# Altium schematic sheet stm32h750xbh6.SchDoc: MCU
size A4; Date: 10.04.2025; CheckedBy: BCY; DrawnBy: miaow; DocumentNumber: 5; Revision: v0.0.1; SheetNumber: 5; SheetTotal: 12; Sample: A0; Url: github.com/miaow-cn/pcb-lib; Liscense: GPLv3; Board: MIAOW FOC BOARD; BoardType: MAIN_PCB; Desc: stm32h750xbh6
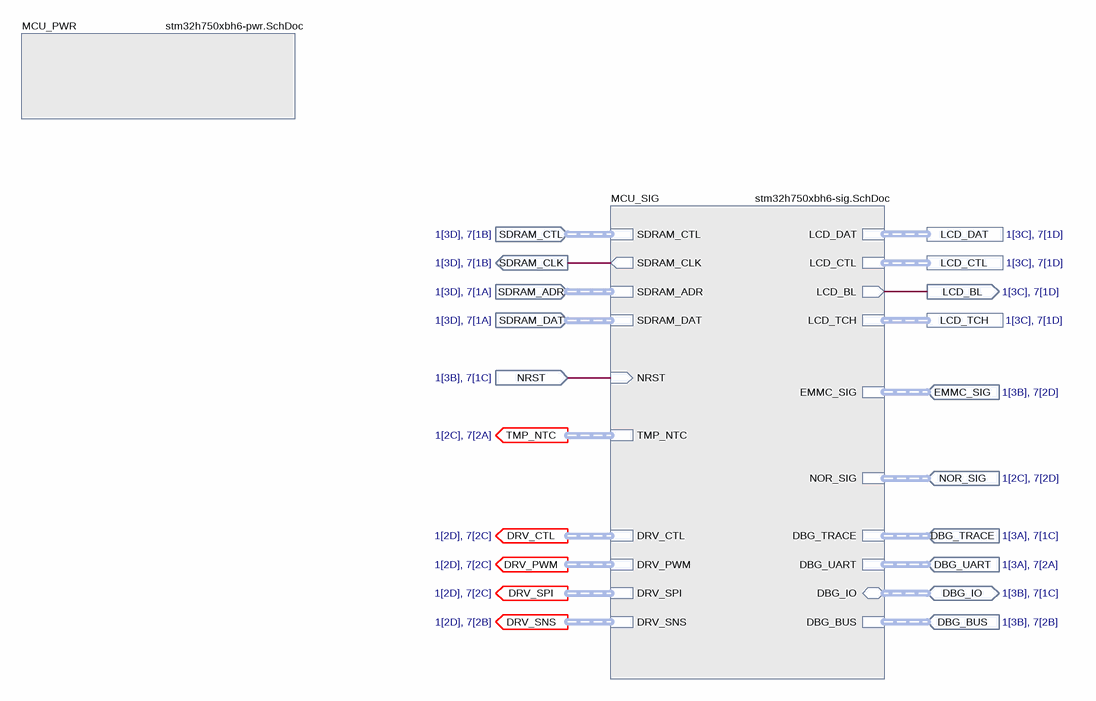
[diagram p0: stm32h750xbh6.SchDoc]

## Sub-sheets
MCU_PWR = stm32h750xbh6-pwr.SchDoc: no entries
MCU_SIG = stm32h750xbh6-sig.SchDoc: SDRAM_CTL (harness SDRAM_CTL), SDRAM_CLK (out), SDRAM_DAT (harness SDRAM_DAT), SDRAM_ADR (harness SDRAM_ADR), NRST (in), DRV_CTL (harness DRV_CTL), DRV_PWM (harness DRV_PWM), DRV_SPI (harness DRV_SPI), DRV_SNS (harness DRV_SNS), LCD_DAT (harness LCD_DAT), LCD_CTL (harness LCD_CTL), LCD_BL (out), LCD_TCH (harness LCD_TCH), EMMC_SIG (harness EMMC_SIG), NOR_SIG (harness NOR_SIG), DBG_TRACE (harness DBG_TRACE), DBG_UART (harness DBG_UART), DBG_IO (bidir, harness DBG_IO), DBG_BUS (harness DBG_BUS), TMP_NTC (harness TMP_NTC)

## Ports
DBG_BUS (in, harness DBG_BUS, see 1[3B], 7[2B]), DBG_IO (bidir, harness DBG_IO, see 1[3B], 7[1C]), DBG_TRACE (in, harness DBG_TRACE, see 1[3A], 7[1C]), DBG_UART (in, harness DBG_UART, see 1[3A], 7[2A]), DRV_CTL (out, harness DRV_CTL, see 1[2D], 7[2C]), DRV_PWM (out, harness DRV_PWM, see 1[2D], 7[2C]), DRV_SNS (out, harness DRV_SNS, see 1[2D], 7[2B]), DRV_SPI (out, harness DRV_SPI, see 1[2D], 7[2C]), EMMC_SIG (in, harness EMMC_SIG, see 1[3B], 7[2D]), LCD_BL (out, see 1[3C], 7[1D]), LCD_CTL (harness LCD_CTL, see 1[3C], 7[1D]), LCD_DAT (harness LCD_DAT, see 1[3C], 7[1D]), LCD_TCH (harness LCD_TCH, see 1[3C], 7[1D]), NOR_SIG (in, harness NOR_SIG, see 1[2C], 7[2D]), NRST (in, see 1[3B], 7[1C]), SDRAM_ADR (in, harness SDRAM_ADR, see 1[3D], 7[1A]), SDRAM_CLK (out, see 1[3D], 7[1B]), SDRAM_CTL (in, harness SDRAM_CTL, see 1[3D], 7[1B]), SDRAM_DAT (in, harness SDRAM_DAT, see 1[3D], 7[1A]), TMP_NTC (out, harness TMP_NTC, see 1[2C], 7[2A])

## Nets
LCD_BL: port LCD_BL, sheet MCU_SIG/LCD_BL
NRST: port NRST, sheet MCU_SIG/NRST
SDRAM_CLK: port SDRAM_CLK, sheet MCU_SIG/SDRAM_CLK

## Buses and harness runs
harness port DBG_BUS = sheet MCU_SIG/DBG_BUS
harness port DBG_IO = sheet MCU_SIG/DBG_IO
harness port DBG_TRACE = sheet MCU_SIG/DBG_TRACE
harness port DBG_UART = sheet MCU_SIG/DBG_UART
harness port DRV_CTL = sheet MCU_SIG/DRV_CTL
harness port DRV_PWM = sheet MCU_SIG/DRV_PWM
harness port DRV_SNS = sheet MCU_SIG/DRV_SNS
harness port DRV_SPI = sheet MCU_SIG/DRV_SPI
harness port EMMC_SIG = sheet MCU_SIG/EMMC_SIG
harness port LCD_CTL = sheet MCU_SIG/LCD_CTL
harness port LCD_DAT = sheet MCU_SIG/LCD_DAT
harness port LCD_TCH = sheet MCU_SIG/LCD_TCH
harness port NOR_SIG = sheet MCU_SIG/NOR_SIG
harness port SDRAM_ADR = sheet MCU_SIG/SDRAM_ADR
harness port SDRAM_CTL = sheet MCU_SIG/SDRAM_CTL
harness port SDRAM_DAT = sheet MCU_SIG/SDRAM_DAT
harness port TMP_NTC = sheet MCU_SIG/TMP_NTC

## Notes on the sheet
- DRAWN
- CHECKED
- DRAWNBY
- SHEETS
- SHEETS_NO